# Altium project G5_Adapted.PrjPcb
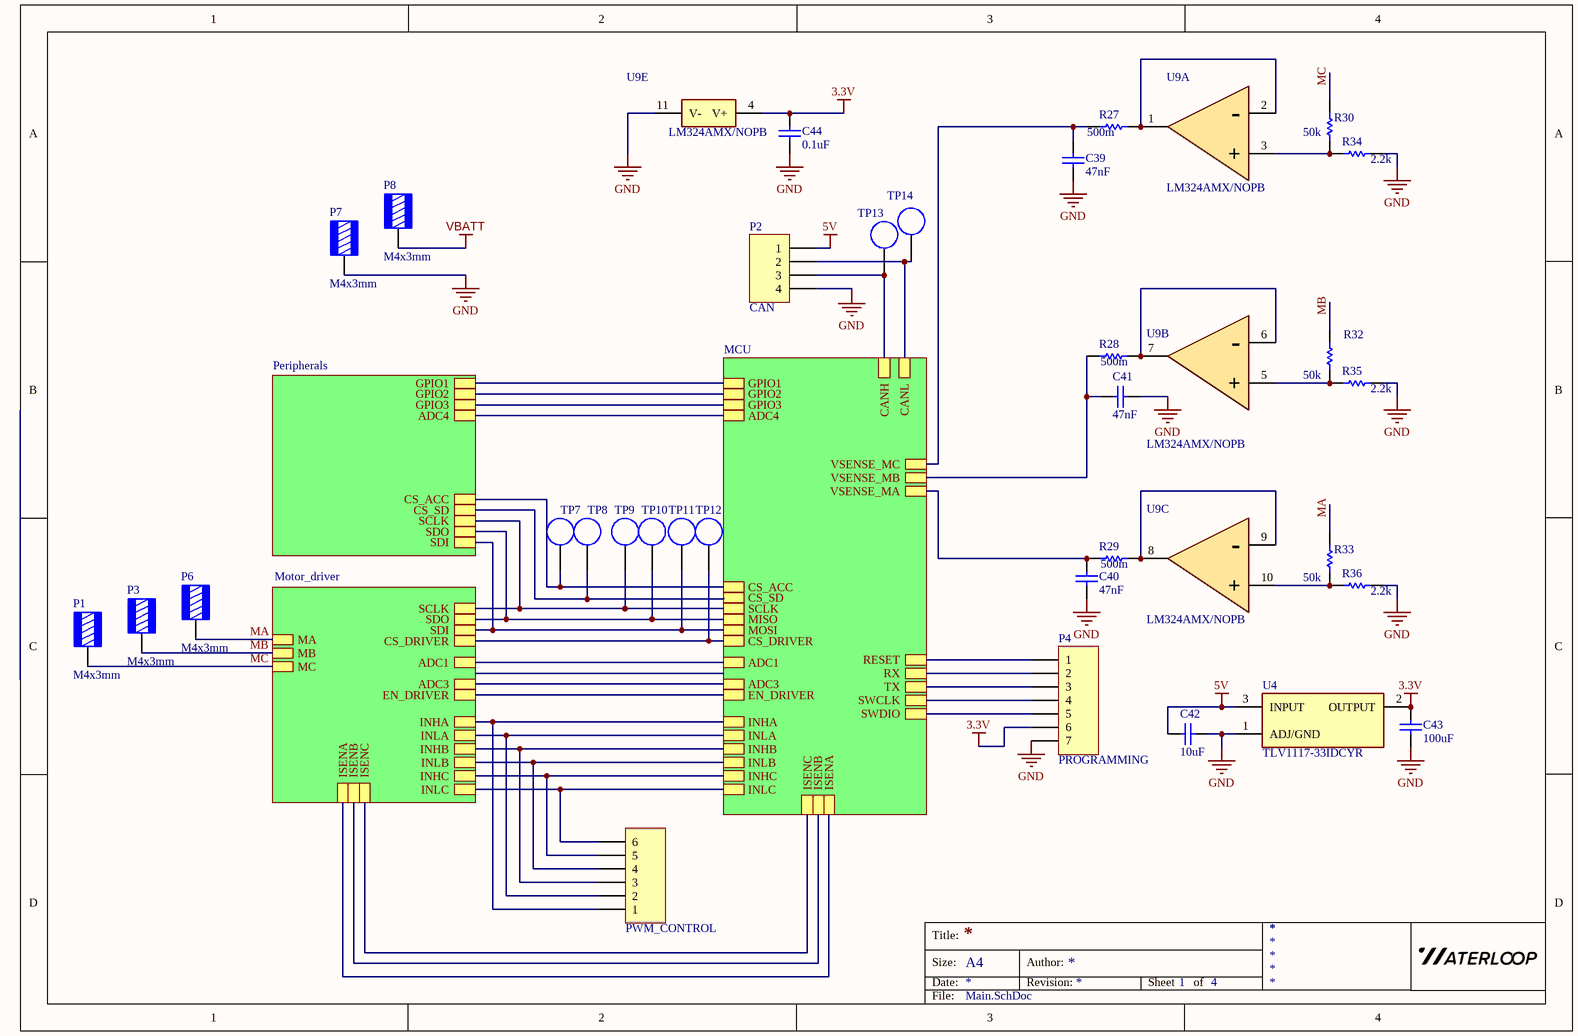
[diagram p0: Main.SchDoc]
4 sheets, 133 parts. Net scope: hierarchical (ports join the sheet entries above them; power ports are global).
Board file: G5_Adapted.PcbDoc
Sheets:
  Main.SchDoc
    MCU = MCU.SchDoc
    Motor_driver = Motor_driver.SchDoc
    Peripherals = Peripherals.SchDoc

## Sheet Main.SchDoc
size A4; SheetNumber: 1; SheetTotal: 4

### Parts
C39  value 47nF  [0805 - Capacitor]  (hidden comment: 100V)
C40  value 47nF  [0805 - Capacitor]  (hidden comment: 100V)
C41  value 47nF  [0805 - Capacitor]  (hidden comment: 100V)
C42  value 10uF  [0805 - Capacitor]  (hidden comment: 100V)
C43  value 100uF  [0805 - Capacitor]  (hidden comment: 100V)
C44  value 0.1uF  [0805 - Capacitor]  (hidden comment: 100V)
P1  M4x3mm  [74650094]
P2  CAN  [b4b-xh]
P3  M4x3mm  [74650094]
P4  PROGRAMMING  [HDR1X7]
P6  M4x3mm  [74650094]
P7  M4x3mm  [74650094]
P8  M4x3mm  [74650094]
R27  500m  [0603 - Resistor]
R28  500m  [0603 - Resistor]
R29  500m  [0603 - Resistor]
R30  50k  [0603 - Resistor]
R32  50k  [0603 - Resistor]
R33  50k  [0603 - Resistor]
R34  2.2k  [0603 - Resistor]
R35  2.2k  [0603 - Resistor]
R36  2.2k  [0603 - Resistor]
TP7  Test Point  [Test Point]  (value not drawn)  (no BOM)
TP8  Test Point  [Test Point]  (value not drawn)  (no BOM)
TP9  Test Point  [Test Point]  (value not drawn)  (no BOM)
TP10  Test Point  [Test Point]  (value not drawn)  (no BOM)
TP11  Test Point  [Test Point]  (value not drawn)  (no BOM)
TP12  Test Point  [Test Point]  (value not drawn)  (no BOM)
TP13  Test Point  [Test Point]  (value not drawn)  (no BOM)
TP14  Test Point  [Test Point]  (value not drawn)  (no BOM)
U4  TLV1117-33IDCYR  [TLV1117]
U9  LM324AMX/NOPB  [LM324AMX/NOPB]  (parts A,B,C,E of 5)
  PWM_CONTROL  [B6B-XH-A(LF)(SN)]

### Sub-sheets
MCU = MCU.SchDoc: CANH, CANL, MOSI, MISO, SCLK, ADC1, INLA, INHA, INHB, INHC, GPIO2, INLB, INLC, SWDIO, SWCLK, TX, GPIO3, RX, GPIO1, CS_SD, ADC4, ADC3, ISENA, ISENB, ISENC, RESET, CS_ACC, CS_DRIVER, EN_DRIVER, VSENSE_MC, VSENSE_MB, VSENSE_MA
Motor_driver = Motor_driver.SchDoc: SCLK, MA, MB, MC, INHA, INLA, INLC, INLB, INHB, INHC, SDO, SDI, ADC1, ADC3, ISENC, ISENA, ISENB, EN_DRIVER, CS_DRIVER
Peripherals = Peripherals.SchDoc: SCLK, GPIO1, GPIO2, GPIO3, SDI, SDO, CS_SD, ADC4, CS_ACC

### Nets
3.3V: C43.1 C44.2 P4.6 U4.2(OUTPUT) U9.4(V+)
5V: C42.1 P2.1 U4.3(INPUT)
GND: C39.1 C40.1 C41.1 C42.2 C43.2 C44.1 P2.4 P4.7 P7.1 R34.1 R35.1 R36.1 U4.1(ADJ/GND) U9.11(V-)
VBATT: P8.1
ADC1: sheet MCU/ADC1, sheet Motor_driver/ADC1
ADC3: sheet MCU/ADC3, sheet Motor_driver/ADC3
ADC4: sheet MCU/ADC4, sheet Peripherals/ADC4
CANH: P2.3 TP13.0 ; sheet MCU/CANH
CANL: P2.2 TP14.0 ; sheet MCU/CANL
CS_ACC: TP7.0 ; sheet MCU/CS_ACC, sheet Peripherals/CS_ACC
CS_DRIVER: TP12.0 ; sheet MCU/CS_DRIVER, sheet Motor_driver/CS_DRIVER
CS_SD: TP8.0 ; sheet MCU/CS_SD, sheet Peripherals/CS_SD
EN_DRIVER: sheet MCU/EN_DRIVER, sheet Motor_driver/EN_DRIVER
GPIO1: sheet MCU/GPIO1, sheet Peripherals/GPIO1
GPIO2: sheet MCU/GPIO2, sheet Peripherals/GPIO2
GPIO3: sheet MCU/GPIO3, sheet Peripherals/GPIO3
INHA: .1 ; sheet MCU/INHA, sheet Motor_driver/INHA
INHB: .3 ; sheet MCU/INHB, sheet Motor_driver/INHB
INHC: .5 ; sheet MCU/INHC, sheet Motor_driver/INHC
INLA: .2 ; sheet MCU/INLA, sheet Motor_driver/INLA
INLB: .4 ; sheet MCU/INLB, sheet Motor_driver/INLB
INLC: .6 ; sheet MCU/INLC, sheet Motor_driver/INLC
ISENA: sheet MCU/ISENA, sheet Motor_driver/ISENA
ISENB: sheet MCU/ISENB, sheet Motor_driver/ISENB
ISENC: sheet MCU/ISENC, sheet Motor_driver/ISENC
MA: P6.1 R33.1 ; sheet Motor_driver/MA
MB: P3.1 R32.1 ; sheet Motor_driver/MB
MC: P1.1 R30.1 ; sheet Motor_driver/MC
RESET: P4.1 ; sheet MCU/RESET
RX: P4.2 ; sheet MCU/RX
SCLK: TP9.0 ; sheet MCU/SCLK, sheet Motor_driver/SCLK, sheet Peripherals/SCLK
SDI: TP11.0 ; sheet MCU/MOSI, sheet Motor_driver/SDI, sheet Peripherals/SDI
SDO: TP10.0 ; sheet MCU/MISO, sheet Motor_driver/SDO, sheet Peripherals/SDO
SWCLK: P4.4 ; sheet MCU/SWCLK
SWDIO: P4.5 ; sheet MCU/SWDIO
TX: P4.3 ; sheet MCU/TX
VSENSE_MA: C40.2 R29.2 ; sheet MCU/VSENSE_MA
VSENSE_MB: C41.2 R28.2 ; sheet MCU/VSENSE_MB
VSENSE_MC: C39.2 R27.2 ; sheet MCU/VSENSE_MC
NetR27_1: R27.1 U9.1 U9.2(-)
NetR28_1: R28.1 U9.6(-) U9.7
NetR29_1: R29.1 U9.8 U9.9(-)
NetR30_2: R30.2 R34.2 U9.3(+)
NetR32_2: R32.2 R35.2 U9.5(+)
NetR33_2: R33.2 R36.2 U9.10(+)

### Notes on the sheet
- Title:
- Size:
- Date:
- A4
- Author:
- Revision:
- Sheet
- of
- File:

### Library data of the parts
C39-C44 = Capacitor - Nonpolarized: CL21B104KCFNNNE, MULTILAYER CERAMIC CAPACITORS MLCC - SMD/SMT 100NF 100V 0805 ROHS; Supplier Part Number: *; Supplier: *; Manufacturer: *; Rating: *; Manufacturer Part Number: *
P1 P3 P6-P8 = 74650094R: WP-THRBU REDCUBE THR internal through-hole thread, 10x10mm, M4x3mm, 8 pins, 85A; Pin Number: 8; Thread: M4; Surface: Tin; Thread Length: 3mm; ComponentLink1Description: Manufacturer; ComponentLink1URL: http://www.we-online.de; ComponentLink2Description: Datasheet; ComponentLink2URL: https://katalog.we-online.com/em/datasheet/74650094R.pdf; Operating Temperature: -55 to +150degC; Height: 3.5mm; Material: Brass; Part Number: 74650094R; Packaging: Tape and Reel; Mounting Technology: SMT; Rated Current: 85A; Publisher: Wurth Elektronik; Published Date: September 2019; Size: 10x10mm
P2 = Header 4: Header, 4-Pin; LatestRevisionDate: 17-Jul-2002; LatestRevisionNote: Re-released for DXP Platform.; Publisher: Altium Limited
P4 = Header 7: Header, 7-Pin; LatestRevisionDate: 17-Jul-2002; LatestRevisionNote: Re-released for DXP Platform.; Publisher: Altium Limited
R27-R30 R32-R36 = Resistor: Rating: *; Manufacturer Part Number: *; Manufacturer: *; Supplier Part Number: *; Supplier: *
  R27-R29: Value: 500m
  R30 R32 R33: Value: 50k
  R34-R36: Value: 2.2k
U4 = TLV1117-33IDCYR: Linear Voltage Regulator IC 3.3V 800MA SOT223-4; Manufacturer: Texas Instruments; Datasheet: http://www.ti.com/lit/ds/symlink/tlv1117.pdf?HQS=TI-null-null-digikeymode-df-pf-null-wwe&ts=1590668900314; Manufacturer Part Number: TLV1117-33IDCYR; Supplier Part Number: 296-21112-1-ND; Supplier: Digikey
U9 = LM324AMX/NOPB: Gen Purp 4Ch Opamp; Manufacturer: TI; Manufacturer Part Number: LM324AMX/NOPB; Supplier Part Number: LM324AMX/NOPBCT-ND; Supplier: Digikey; ComponentLink1Description: Datasheet; ComponentLink1URL: https://www.ti.com/lit/ds/symlink/lm124-n.pdf?HQS=dis-dk-null-digikeymode-dsf-pf-null-wwe&ts=1616555832552
 = Header 6: Header, 6-Pin

## Sheet MCU.SchDoc
size A4; SheetNumber: 2; SheetTotal: 4
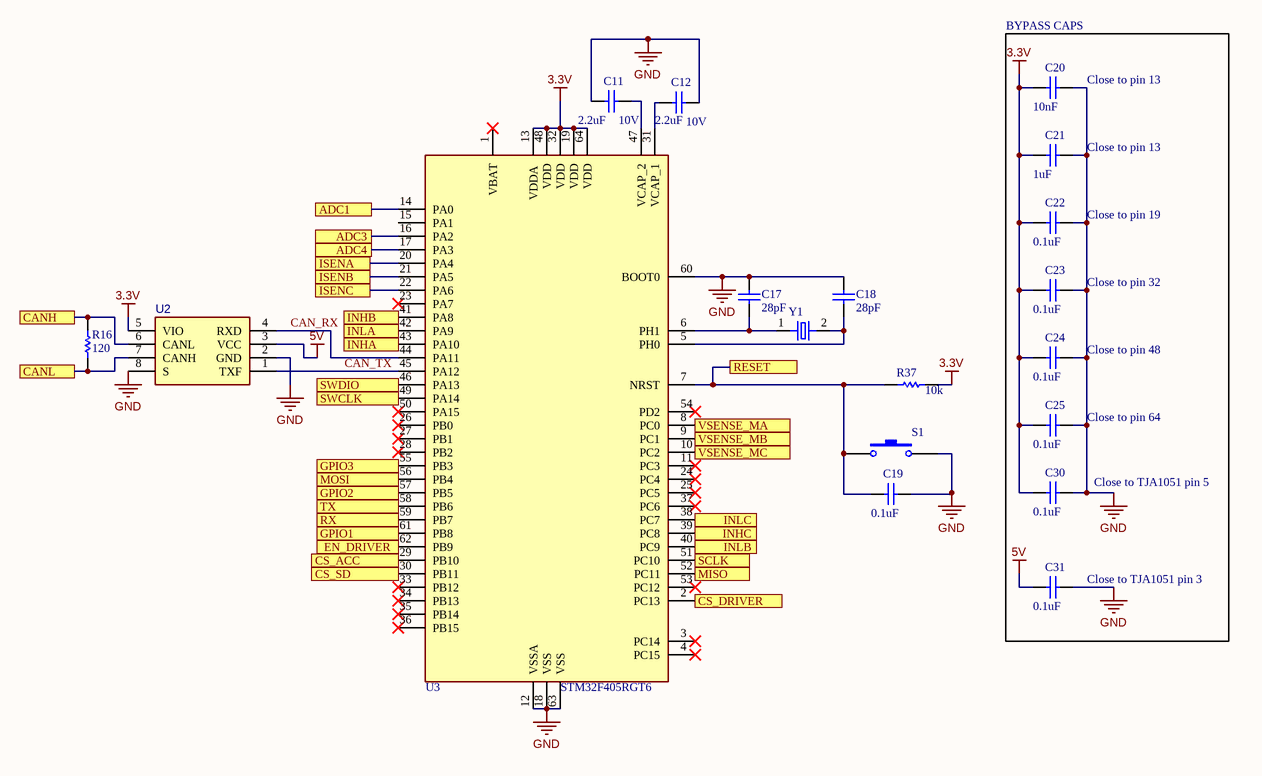
[diagram p1: MCU.SchDoc]

### Parts
C11  10V  value 2.2uF  [0805 - Capacitor]
C12  10V  value 2.2uF  [0805 - Capacitor]
C17  value 28pF  [0805 - Capacitor]  (hidden comment: 100V)
C18  value 28pF  [0805 - Capacitor]  (hidden comment: 100V)
C19  value 0.1uF  [0805 - Capacitor]  (hidden comment: 100V)
C20  value 10nF  [0805 - Capacitor]  (hidden comment: 10V)
C21  value 1uF  [0805 - Capacitor]  (hidden comment: 100V)
C22  value 0.1uF  [0805 - Capacitor]  (hidden comment: 100V)
C23  value 0.1uF  [0805 - Capacitor]  (hidden comment: 100V)
C24  value 0.1uF  [0805 - Capacitor]  (hidden comment: 100V)
C25  value 0.1uF  [0805 - Capacitor]  (hidden comment: 100V)
C30  value 0.1uF  [0805 - Capacitor]  (hidden comment: 100V)
C31  value 0.1uF  [0805 - Capacitor]  (hidden comment: 100V)
R16  value 120  [0603 - Resistor]  (hidden comment: 500m)
R37  10k  [0603 - Resistor]
S1  Switch - Push Button  [6x6mm Switch]  (value not drawn)
U2  (no value)  [TJA1051T/3,118]
U3  STM32F405RGT6  [STM32F405RG]
Y1  ABM3-16.000MHZ-B2-T  [ABM3-16.000MHZ-B2-T]  (value not drawn)

### Ports
ADC1, ADC3, ADC4, CANH, CANL, CS_ACC, CS_DRIVER, CS_SD, EN_DRIVER, GPIO1, GPIO2, GPIO3, INHA, INHB, INHC, INLA, INLB, INLC, ISENA, ISENB, ISENC, MISO, MOSI, RESET, RX, SCLK, SWCLK, SWDIO, TX, VSENSE_MA, VSENSE_MB, VSENSE_MC

### Nets
3.3V: C20.1 C21.1 C22.1 C23.1 C24.1 C25.1 C30.1 R37.1 U2.5(VIO) U3.13(VDDA) U3.19(VDD) U3.32(VDD) U3.48(VDD) U3.64(VDD)
5V: C31.1 U2.3(VCC)
GND: C11.1 C12.2 C17.2 C18.2 C19.2 C20.2 C21.2 C22.2 C23.2 C24.2 C25.2 C30.2 C31.2 S1.2 U2.2(GND) U2.8(S) U3.12(VSSA) U3.18(VSS) U3.60(BOOT0) U3.63(VSS)
ADC1: U3.14(PA0) ; port ADC1
ADC3: U3.16(PA2) ; port ADC3
ADC4: U3.17(PA3) ; port ADC4
CAN_RX: U2.4(RXD) U3.44(PA11)
CAN_TX: U2.1(TXF) U3.45(PA12)
CANH: R16.1 U2.6(CANL) ; port CANH
CANL: R16.2 U2.7(CANH) ; port CANL
CS_ACC: U3.29(PB10) ; port CS_ACC
CS_DRIVER: U3.2(PC13) ; port CS_DRIVER
CS_SD: U3.30(PB11) ; port CS_SD
EN_DRIVER: U3.62(PB9) ; port EN_DRIVER
GPIO1: U3.61(PB8) ; port GPIO1
GPIO2: U3.57(PB5) ; port GPIO2
GPIO3: U3.55(PB3) ; port GPIO3
INHA: U3.43(PA10) ; port INHA
INHB: U3.41(PA8) ; port INHB
INHC: U3.39(PC8) ; port INHC
INLA: U3.42(PA9) ; port INLA
INLB: U3.40(PC9) ; port INLB
INLC: U3.38(PC7) ; port INLC
ISENA: U3.20(PA4) ; port ISENA
ISENB: U3.21(PA5) ; port ISENB
ISENC: U3.22(PA6) ; port ISENC
RESET: C19.1 R37.2 S1.1 U3.7(NRST) ; port RESET
RX: U3.59(PB7) ; port RX
SCLK: U3.51(PC10) ; port SCLK
SDI: U3.56(PB4) ; port MOSI
SDO: U3.52(PC11) ; port MISO
SWCLK: U3.49(PA14) ; port SWCLK
SWDIO: U3.46(PA13) ; port SWDIO
TX: U3.58(PB6) ; port TX
VSENSE_MA: U3.8(PC0) ; port VSENSE_MA
VSENSE_MB: U3.9(PC1) ; port VSENSE_MB
VSENSE_MC: U3.10(PC2) ; port VSENSE_MC
NetC11_2: C11.2 U3.47(VCAP_2)
NetC12_1: C12.1 U3.31(VCAP_1)
NetC17_1: C17.1 U3.6(PH1) Y1.1
NetC18_1: C18.1 U3.5(PH0) Y1.2

Not connected (* = marked no-connect by the designer): U3 1(VBAT)* 3(PC14)* 4(PC15)* 11(PC3)* 15(PA1) 23(PA7)* 24(PC4)* 25(PC5)* 26(PB0)* 27(PB1)* 28(PB2)* 33(PB12)* 34(PB13)* 35(PB14)* 36(PB15)* 37(PC6)* 50(PA15)* 53(PC12)* 54(PD2)*

### Notes on the sheet
- BYPASS CAPS
- (near C20) Close to pin 13
- (near C21) Close to pin 13
- (near C22) Close to pin 19
- (near C23) Close to pin 32
- (near C24) Close to pin 48
- (near C25) Close to pin 64
- (near C30) Close to TJA1051 pin 5
- (near C31) Close to TJA1051 pin 3
- Title:
- Size:
- Date:
- A4
- Author:
- Revision:
- Sheet
- of
- File:

### Library data of the parts
C11 C12 = Capacitor - Nonpolarized: Nonpolarized Capacitor; Supplier Part Number: *; Supplier: *; Manufacturer: *; Rating: *; Manufacturer Part Number: *
C17-C19 C22-C25 C30 C31 = Capacitor - Nonpolarized: as C39 on sheet Main; Supplier Part Number: *; Supplier: *; Manufacturer: *; Rating: *; Manufacturer Part Number: *
C20 = Capacitor - Nonpolarized: C0805C103K8RAC7800. 10000pF ±10% 10V Ceramic Capacitor X7R 0805 (2012 Metric) /; Supplier Part Number: *; Supplier: *; Manufacturer: *; Rating: *; Manufacturer Part Number: *
C21 = Capacitor - Nonpolarized: TDK C2012X7S2A105KT000N, 1UF ±10% 100V X7S 0805 MULTILAYER CERAMIC CAPACITORS MLCC - SMD/SMT ROHS; Supplier Part Number: *; Supplier: *; Manufacturer: *; Rating: *; Manufacturer Part Number: *
R16 R37 = Resistor: Rating: *; Manufacturer Part Number: *; Manufacturer: *; Supplier Part Number: *; Supplier: *
  R37: Value: 10k
S1 = Switch - Push Button: Push Button Switch; Supplier: *; Manufacturer Part Number: *; Manufacturer: *; Supplier Part Number: *; Rating: *; Value: *
U2 = TJA1051T_3,118: Integrated Circuit; Manufacturer_Name: NXP; Datasheet Link: http://www.nxp.com/docs/en/data-sheet/TJA1051.pdf; Height: 1.75mm; Manufacturer_Part_Number: TJA1051T/3,118; Arrow Part Number: TJA1051T/3,118; Arrow Price/Stock: https://www.arrow.com/en/products/tja1051t3118/nxp-semiconductors; Mouser Part Number: 771-TJA1051T3118; Mouser Price/Stock: https://www.mouser.co.uk/ProductDetail/NXP-Semiconductors/TJA1051T-3118?qs=O%2F7ihdSJpebv1PFlp05wnQ%3D%3D
U3 = STM32F405RGT6: ST 64-pin Micro; Manufacturer Part Number: STM32F405RG; Manufacturer: ST; Supplier Part Number: 497-11767-ND; Supplier: Digikey; ComponentLink1Description: Datsheet; ComponentLink1URL: https://www.st.com/content/ccc/resource/technical/document/datasheet/ef/92/76/6d/bb/c2/4f/f7/DM00037051.pdf/files/DM00037051.pdf/jcr:content/translations/en.DM00037051.pdf
Y1 = ABM3-16.000MHZ-B2-T: 16MHz Â±20ppm Crystal 18pF 40 Ohms 2-SMD, No Lead; MF: Abracon; Value: *; MP: ABM3-16.000MHZ-B2-T; Package: SMD-2 Abracon; SnapEDA_Link: https://www.snapeda.com/parts/ABM3-16.000MHZ-B2-T/Abracon%20LLC/view-part/55266/?ref=snap; Digi-Key_Part_Number: 535-9103-1-ND; Digi-Key_Purchase_URL: https://www.digikey.com/product-detail/en/abracon-llc/ABM3-16.000MHZ-B2-T/535-9103-1-ND/675620?utm_source=snapeda&utm_medium=aggregator&utm_campaign=symbol

## Sheet Motor_driver.SchDoc
size A4; SheetNumber: 3; SheetTotal: 4
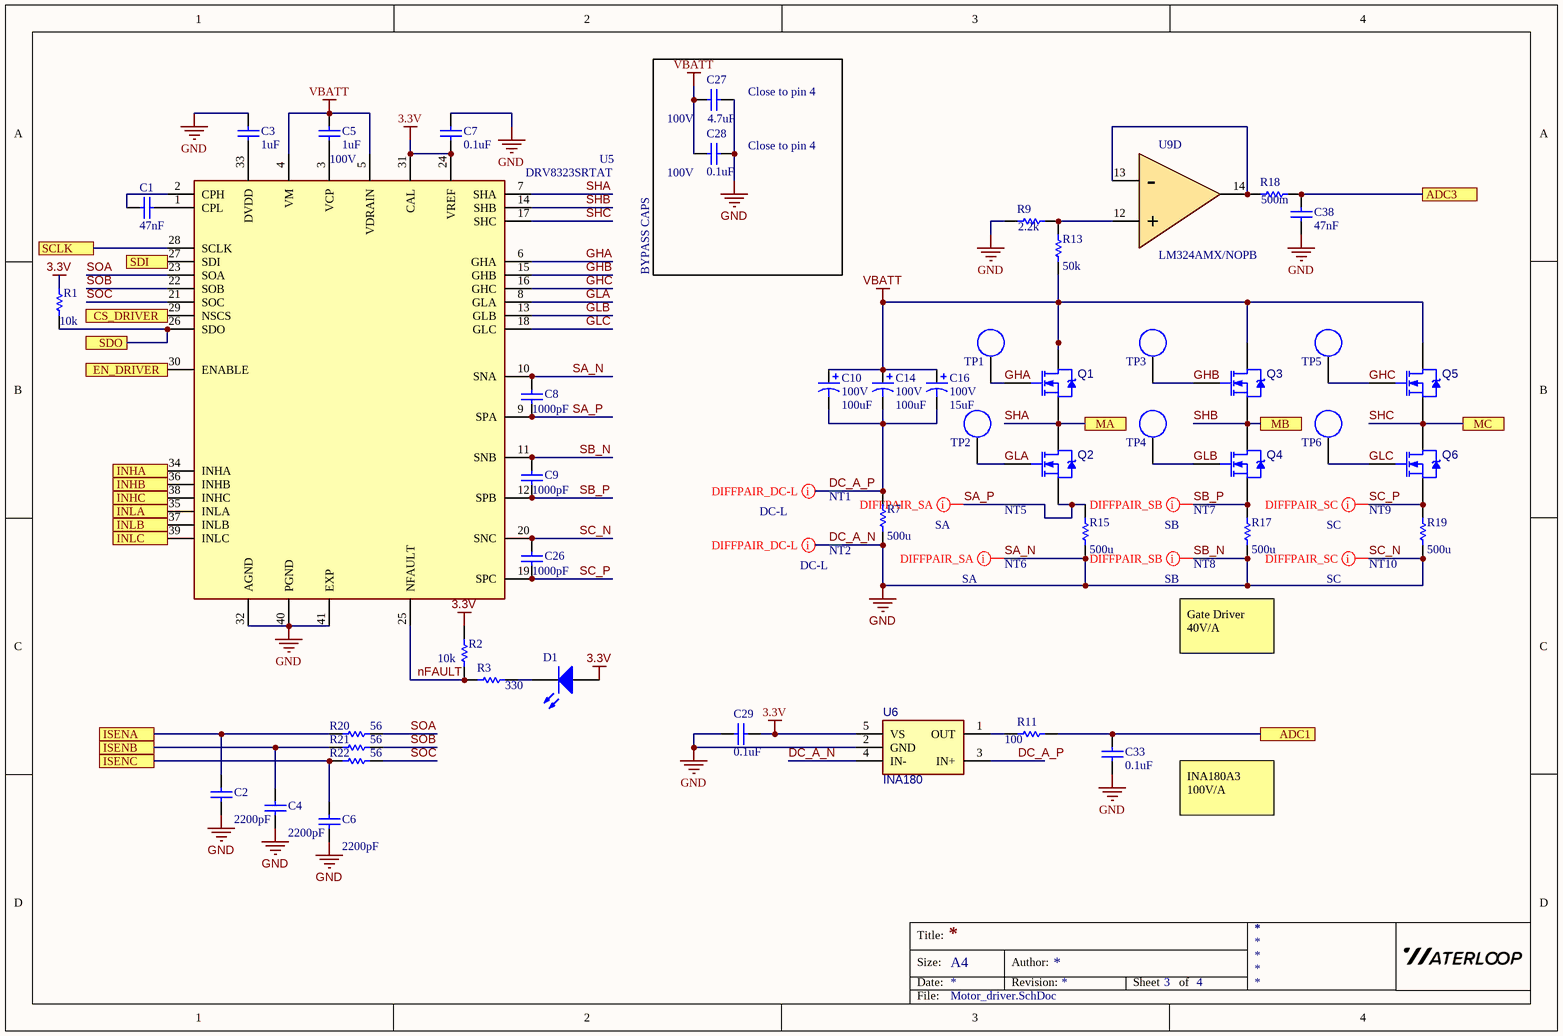
[diagram p2: Motor_driver.SchDoc]

### Parts
C1  value 47nF  [0805 - Capacitor]  (hidden comment: 100V)
C2  value 2200pF  [0805 - Capacitor]  (hidden comment: 10V)
C3  value 1uF  [0805 - Capacitor]  (hidden comment: 100V)
C4  value 2200pF  [0805 - Capacitor]  (hidden comment: 10V)
C5  100V  value 1uF  [0805 - Capacitor]
C6  value 2200pF  [0805 - Capacitor]  (hidden comment: 10V)
C7  value 0.1uF  [0805 - Capacitor]  (hidden comment: 100V)
C8  value 1000pF  [0805 - Capacitor]  (hidden comment: 10V)
C9  value 1000pF  [0805 - Capacitor]  (hidden comment: 10V)
C10  100V  value 100uF  [Electrolytic Cap]
C14  100V  value 100uF  [Electrolytic Cap]
C16  100V  value 15uF  [Electrolytic Cap]
C26  value 1000pF  [0805 - Capacitor]  (hidden comment: 10V)
C27  100V  value 4.7uF  [1210 - Capacitor]
C28  100V  value 0.1uF  [0805 - Capacitor]
C29  value 0.1uF  [0805 - Capacitor]  (hidden comment: 100V)
C33  value 0.1uF  [0805 - Capacitor]  (hidden comment: 100V)
C38  value 47nF  [0805 - Capacitor]  (hidden comment: 100V)
D1  150080SS75000  [0805_A]  (value not drawn)
NT1  NetTie  [Net Tie]  (value not drawn)  (net tie, no BOM)
NT2  NetTie  [Net Tie]  (value not drawn)  (net tie, no BOM)
NT5  NetTie  [Net Tie]  (value not drawn)  (net tie, no BOM)
NT6  NetTie  [Net Tie]  (value not drawn)  (net tie, no BOM)
NT7  NetTie  [Net Tie]  (value not drawn)  (net tie, no BOM)
NT8  NetTie  [Net Tie]  (value not drawn)  (net tie, no BOM)
NT9  NetTie  [Net Tie]  (value not drawn)  (net tie, no BOM)
NT10  NetTie  [Net Tie]  (value not drawn)  (net tie, no BOM)
Q1  NMOS-2  [TO254P1651X1067X470-3]  (value not drawn)
Q2  NMOS-2  [TO254P1651X1067X470-3]  (value not drawn)
Q3  NMOS-2  [TO254P1651X1067X470-3]  (value not drawn)
Q4  NMOS-2  [TO254P1651X1067X470-3]  (value not drawn)
Q5  NMOS-2  [TO254P1651X1067X470-3]  (value not drawn)
Q6  NMOS-2  [TO254P1651X1067X470-3]  (value not drawn)
R1  10k  [0603 - Resistor]
R2  10k  [0603 - Resistor]
R3  330  [0603 - Resistor]
R7  500u  [RESC6430X66N]
R9  2.2k  [0603 - Resistor]
R11  100  [0603 - Resistor]
R13  50k  [0603 - Resistor]
R15  500u  [RESC6430X66N]
R17  500u  [RESC6430X66N]
R18  500m  [0603 - Resistor]
R19  500u  [RESC6430X66N]
R20  56  [0603 - Resistor]
R21  56  [0603 - Resistor]
R22  56  [0603 - Resistor]
TP1  Test Point  [Test Point]  (value not drawn)  (no BOM)
TP2  Test Point  [Test Point]  (value not drawn)  (no BOM)
TP3  Test Point  [Test Point]  (value not drawn)  (no BOM)
TP4  Test Point  [Test Point]  (value not drawn)  (no BOM)
TP5  Test Point  [Test Point]  (value not drawn)  (no BOM)
TP6  Test Point  [Test Point]  (value not drawn)  (no BOM)
U5  DRV8323SRTAT  [DRV8323SRTAT]
U6  INA180  [INA180]
U9  LM324AMX/NOPB  [LM324AMX/NOPB]  (part D of 5)

### Ports
ADC1, ADC3, CS_DRIVER, EN_DRIVER, INHA, INHB, INHC, INLA, INLB, INLC, ISENA, ISENB, ISENC, MA, MB, MC, SCLK, SDI, SDO

### Nets
3.3V: C7.1 C29.1 D1.2(A) R1.1 R2.1 U5.24(VREF) U5.31(CAL) U6.5(VS)
GND: C2.2 C3.2 C4.2 C6.2 C7.2 C27.1 C28.1 C29.2 C33.2 C38.1 NT2.2 NT6.2 NT8.2 NT10.2 R7.1 R9.1 R15.1 R17.1 R19.1 U5.32(AGND) U5.40(PGND) U5.41(EXP) U6.2(GND)
VBATT: C5.2 C10.1 C14.1 C16.1 C27.2 C28.2 Q1.2(D) Q3.2(D) Q5.2(D) R13.2 U5.4(VM) U5.5(VDRAIN)
ADC1: C33.1 R11.2 ; port ADC1
ADC3: C38.2 R18.2 ; port ADC3
CS_DRIVER: U5.29(NSCS) ; port CS_DRIVER
DC_A_N: NT2.1 U6.4(IN-)
DC_A_P: NT1.1 U6.3(IN+)
EN_DRIVER: U5.30(ENABLE) ; port EN_DRIVER
GHA: Q1.1(G) TP1.0 U5.6(GHA)
GHB: Q3.1(G) TP3.0 U5.15(GHB)
GHC: Q5.1(G) TP5.0 U5.16(GHC)
GLA: Q2.1(G) TP2.0 U5.8(GLA)
GLB: Q4.1(G) TP4.0 U5.13(GLB)
GLC: Q6.1(G) TP6.0 U5.18(GLC)
INHA: U5.34(INHA) ; port INHA
INHB: U5.36(INHB) ; port INHB
INHC: U5.38(INHC) ; port INHC
INLA: U5.35(INLA) ; port INLA
INLB: U5.37(INLB) ; port INLB
INLC: U5.39(INLC) ; port INLC
ISENA: C2.1 R20.2 ; port ISENA
ISENB: C4.1 R21.2 ; port ISENB
ISENC: C6.1 R22.2 ; port ISENC
nFAULT: R2.2 R3.2 U5.25(NFAULT)
SA_N: C8.1 NT6.1 U5.10(SNA)
SA_P: C8.2 NT5.1 U5.9(SPA)
SB_N: C9.1 NT8.1 U5.11(SNB)
SB_P: C9.2 NT7.1 U5.12(SPB)
SC_N: C26.1 NT10.1 U5.20(SNC)
SC_P: C26.2 NT9.1 U5.19(SPC)
SCLK: U5.28(SCLK) ; port SCLK
SDI: U5.27(SDI) ; port SDI
SDO: R1.2 U5.26(SDO) ; port SDO
SHA: Q1.3(S) Q2.2(D) U5.7(SHA) ; port MA  [project net MA]
SHB: Q3.3(S) Q4.2(D) U5.14(SHB) ; port MB  [project net MB]
SHC: Q5.3(S) Q6.2(D) U5.17(SHC) ; port MC  [project net MC]
SOA: R20.1 U5.23(SOA)
SOB: R21.1 U5.22(SOB)
SOC: R22.1 U5.21(SOC)
NetC1_1: C1.1 U5.1(CPL)
NetC1_2: C1.2 U5.2(CPH)
NetC3_1: C3.1 U5.33(DVDD)
NetC5_1: C5.1 U5.3(VCP)
NetC10_2: C10.2 C14.2 C16.2 NT1.2 R7.2
NetD1_1: D1.1(K) R3.1
NetNT5_2: NT5.2 Q2.3(S) R15.2
NetNT7_2: NT7.2 Q4.3(S) R17.2
NetNT9_2: NT9.2 Q6.3(S) R19.2
NetR9_2: R9.2 R13.1 U9.12(+)
NetR11_1: R11.1 U6.1(OUT)
NetR18_1: R18.1 U9.13(-) U9.14

### Layout directives
differential pair; Parameter 1: SA: SA_N, SA_P
differential pair; Parameter 1: SB: SB_N, SB_P
differential pair; Parameter 1: SC: SC_N, SC_P
differential pair; Parameter 1: DC-L: DC_A_N, DC_A_P

### Notes on the sheet
- (near C27) Close to pin 4
- (near C28) Close to pin 4
- BYPASS CAPS
- Gate Driver 40V/A
- INA180A3 100V/A
- Title:
- Size:
- Date:
- A4
- Author:
- Revision:
- Sheet
- of
- File:

### Library data of the parts
C1 C7 C28 C29 C33 C38 = Capacitor - Nonpolarized: as C39 on sheet Main; Supplier Part Number: *; Supplier: *; Manufacturer: *; Rating: *; Manufacturer Part Number: *
C2-C6 C8 C9 C26 C27 = Capacitor - Nonpolarized: as C21 on sheet MCU; Supplier Part Number: *; Supplier: *; Manufacturer: *; Rating: *; Manufacturer Part Number: *
C10 C14 = Cap Pol3: 100ZLH100MEFC10X20, Aluminum Electrolytic Capacitors Radial, Can - 10000 Hrs @ 105°C, 100UF 20% 100V /; Published: 8-Jun-2000; LatestRevisionDate: 29-May-2009; LatestRevisionNote: IPC-7351 Footprint Added.; PackageReference: C0805; Publisher: Altium Limited; PackageDescription: Chip Capacitor
C16 = Cap Pol3: EEU-EE2V150, Aluminum Electrolytic Capacitors Radial, Can - 8000 Hrs @ 105°C, CAP ALUM 15UF 20% 350V RADIAL /; Published: 8-Jun-2000; LatestRevisionDate: 29-May-2009; LatestRevisionNote: IPC-7351 Footprint Added.; PackageReference: C0805; Publisher: Altium Limited; PackageDescription: Chip Capacitor
D1 = CMP-1426-00010-1: SMD mono-color Chip LED, WL-SMCW, Super Red; Manufacturer: Wuerth Elektronik; PackageReference: 0805_A; ComponentLink2URL: http://katalog.we-online.com/led/datasheet/150080SS75000.pdf; ComponentLink1URL: http://www.we-online.com; Color: Super Red; ComponentLink2Description: Datasheet; ComponentLink1Description: Manufacturer URL; PartNumber: 150080SS75000
NT1 NT2 NT5-NT10 = Net Tie
Q1-Q6 = NMOS-2: N-Channel Power MOSFET; Note: Pin 2 is electrically connected to pin 4.; Published: 8-Jun-2000; LatestRevisionDate: 17-Jul-2002; LatestRevisionNote: Re-released for DXP Platform.; DatasheetVersion: PD-9.814; PackageVersion: Feb-1997; PackageReference: TO-220AB; Publisher: Altium Limited; PackageDescription: TO, Thru-Hole, Vertical, Heatsink Mounted; 3 In-Line Leads; Pitch 2.54 mm; ComponentLink1Description: Manufacturer Link; ComponentLink1URL: http://www.irf.com/
R1-R3 R7 R9 R11 R13 R15 R17-R22 = Resistor: Rating: *; Manufacturer Part Number: *; Manufacturer: *; Supplier Part Number: *; Supplier: *
  R1 R2: Value: 10k
  R3: Value: 330
  R7 R15 R17 R19: Value: 500u
  R9: Value: 2.2k
  R11: Value: 100
  R13: Value: 50k
  R18: Value: 500m
  R20-R22: Value: 56
U5 = DRV8323SRTAT: Multiphase Motor Driver Power MOSFET SPI 40-WQFN _6x6_; MF: Texas Instruments; SnapEDA_Link: https://www.snapeda.com/parts/DRV8323SRTAT/Texas%20Instruments/view-part/1675025/?ref=snap; Price: None; MP: DRV8323SRTAT; Package: WQFN-40 Texas Instruments; Value: *; Availability: Unavailable
U6 = INA180: 0V to 26V Current Sense Amplifier; Manufacturer: Texas Instruments; Manufacturer Part Number: INA180A2IDBVR; Datasheet: https://www.ti.com/lit/ds/symlink/ina180.pdf; Supplier Part Number: 296-47653-1-ND; Supplier: Digikey
U9 = LM324AMX/NOPB: Gen Purp 4Ch Opamp; Manufacturer: TI; Manufacturer Part Number: LM324AMX/NOPB; Supplier Part Number: LM324AMX/NOPBCT-ND; Supplier: Digikey; ComponentLink1Description: Datasheet; ComponentLink1URL: https://www.ti.com/lit/ds/symlink/lm124-n.pdf?HQS=dis-dk-null-digikeymode-dsf-pf-null-wwe&ts=1616555832552

## Sheet Peripherals.SchDoc
size A4; SheetNumber: 4; SheetTotal: 4
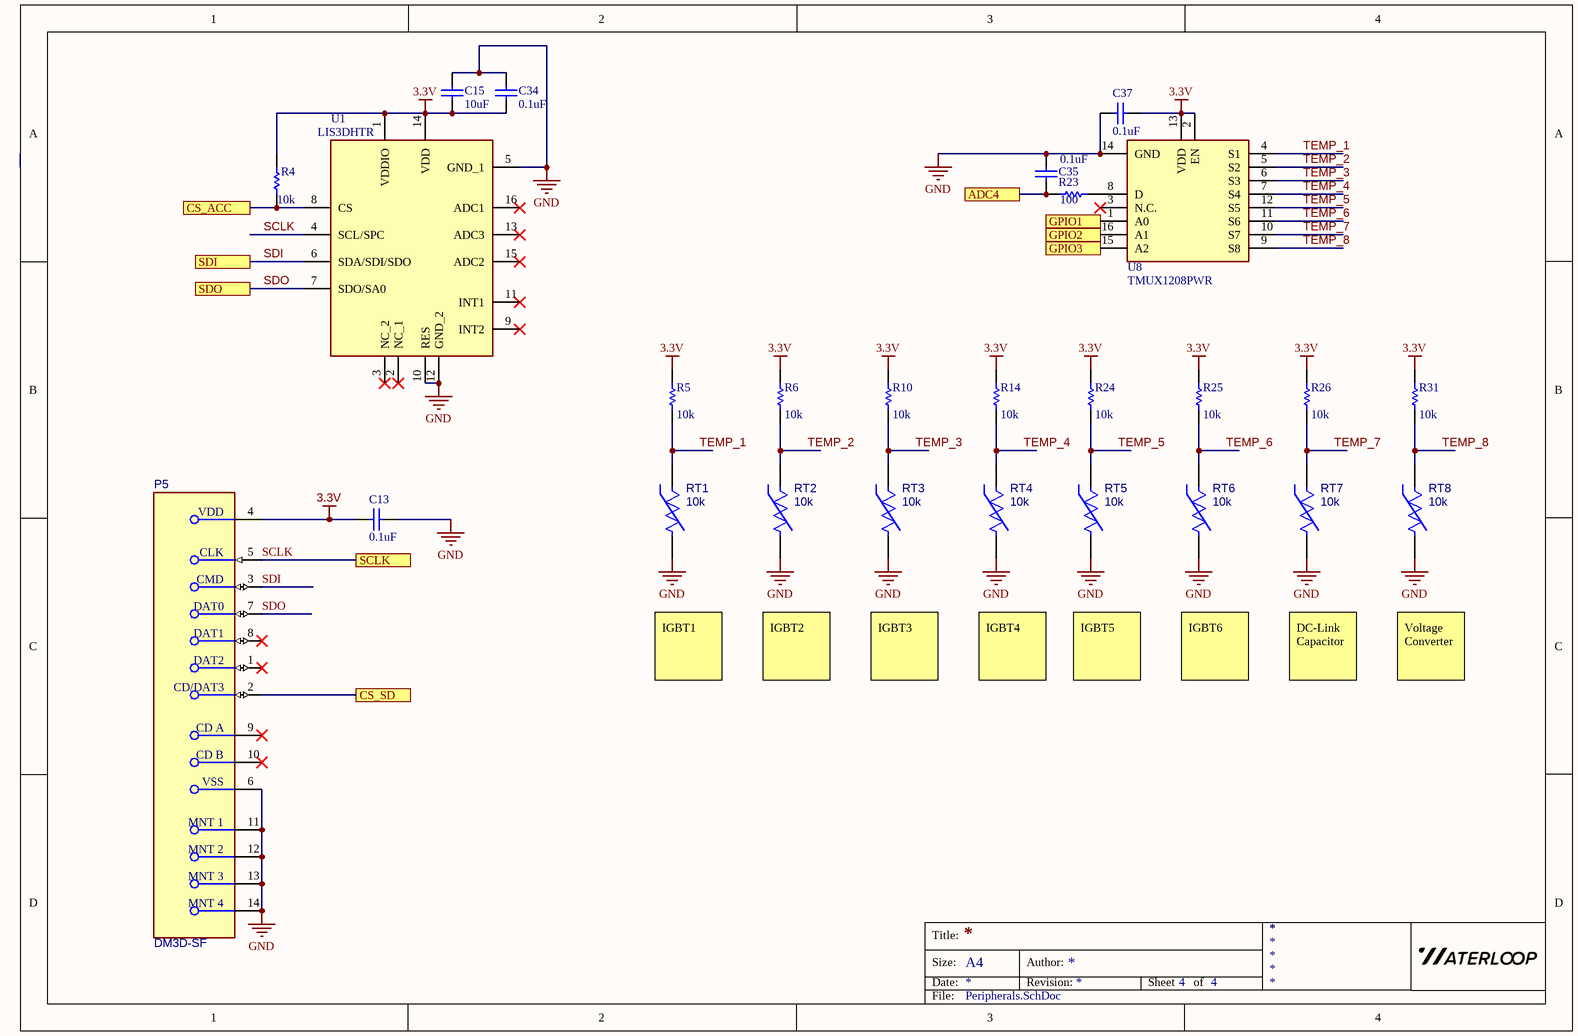
[diagram p3: Peripherals.SchDoc]

### Parts
C13  value 0.1uF  [0805 - Capacitor]  (hidden comment: 100V)
C15  value 10uF  [0805 - Capacitor]  (hidden comment: 100V)
C34  value 0.1uF  [0805 - Capacitor]  (hidden comment: 100V)
C35  value 0.1uF  [0805 - Capacitor]  (hidden comment: 100V)
C37  value 0.1uF  [0805 - Capacitor]  (hidden comment: 100V)
P5  DM3D-SF  [FP-DM3D-SF-MFG]
R4  10k  [0603 - Resistor]
R5  10k  [0603 - Resistor]
R6  10k  [0603 - Resistor]
R10  10k  [0603 - Resistor]
R14  10k  [0603 - Resistor]
R23  100  [0603 - Resistor]
R24  10k  [0603 - Resistor]
R25  10k  [0603 - Resistor]
R26  10k  [0603 - Resistor]
R31  10k  [0603 - Resistor]
RT1  10k  [ERT-J1VG103JA]
RT2  10k  [ERT-J1VG103JA]
RT3  10k  [ERT-J1VG103JA]
RT4  10k  [ERT-J1VG103JA]
RT5  10k  [ERT-J1VG103JA]
RT6  10k  [ERT-J1VG103JA]
RT7  10k  [ERT-J1VG103JA]
RT8  10k  [ERT-J1VG103JA]
U1  LIS3DHTR  [LIS3DHTR]
U8  TMUX1208PWR  [SOP65P640X120-16N]

### Ports
ADC4, CS_ACC, CS_SD, GPIO1, GPIO2, GPIO3, SCLK, SDI, SDO

### Nets
3.3V: C13.2 C15.2 C34.2 C37.1 P5.4(VDD) R4.2 R5.1 R6.2 R10.2 R14.2 R24.2 R25.2 R26.2 R31.2 U1.1(VDDIO) U1.14(VDD) U8.2(EN) U8.13(VDD)
GND: C13.1 C15.1 C34.1 C35.1 C37.2 P5.6(VSS) P5.11(MNT_1) P5.12(MNT_2) P5.13(MNT_3) P5.14(MNT_4) RT1.2 RT2.2 RT3.2 RT4.2 RT5.2 RT6.2 RT7.2 RT8.2 U1.5(GND_1) U1.10(RES) U1.12(GND_2) U8.14(GND)
ADC4: C35.2 R23.2 ; port ADC4
CS_ACC: R4.1 U1.8(CS) ; port CS_ACC
CS_SD: P5.2(CD/DAT3) ; port CS_SD
GPIO1: U8.1(A0) ; port GPIO1
GPIO2: U8.16(A1) ; port GPIO2
GPIO3: U8.15(A2) ; port GPIO3
SCLK: P5.5(CLK) U1.4(SCL/SPC) ; port SCLK
SDI: P5.3(CMD) U1.6(SDA/SDI/SDO) ; port SDI
SDO: P5.7(DAT0) U1.7(SDO/SA0) ; port SDO
TEMP_1: R5.2 RT1.1 U8.4(S1)
TEMP_2: R6.1 RT2.1 U8.5(S2)
TEMP_3: R10.1 RT3.1 U8.6(S3)
TEMP_4: R14.1 RT4.1 U8.7(S4)
TEMP_5: R24.1 RT5.1 U8.12(S5)
TEMP_6: R25.1 RT6.1 U8.11(S6)
TEMP_7: R26.1 RT7.1 U8.10(S7)
TEMP_8: R31.1 RT8.1 U8.9(S8)
NetR23_1: R23.1 U8.8(D)

Not connected (* = marked no-connect by the designer): P5 1(DAT2)* 8(DAT1)* 9(CD_A)* 10(CD_B)*; U1 2(NC_1)* 3(NC_2)* 9(INT2)* 11(INT1)* 13(ADC3)* 15(ADC2)* 16(ADC1)*; U8 3(N.C.)*

### Notes on the sheet
- IGBT1
- IGBT2
- IGBT3
- IGBT4
- IGBT5
- IGBT6
- DC-Link Capacitor
- Voltage Converter
- Title:
- Size:
- Date:
- A4
- Author:
- Revision:
- Sheet
- of
- File:

### Library data of the parts
C13 C15 C34 C35 C37 = Capacitor - Nonpolarized: as C39 on sheet Main; Supplier Part Number: *; Supplier: *; Manufacturer: *; Rating: *; Manufacturer Part Number: *
P5 = CMP-2000-06166-2: CONN MICRO SD CARD PUSH-PULL; Insulation Resistance: 1GR; Max Voltage Rating (AC): 125V; Gender: Female; Contact Resistance: 100mR; Current Rating: 500mA; Pitch: 1.1mm; Connector Type: Connector; Number of Contacts: 8; Contact Plating: Gold; Number of Rows: 1; Termination: Solder; Contact Material: Copper Alloy; REACH SVHC: No SVHC; Voltage Rating (AC): 125V; Packaging: Tape and Reel; Housing Material: Polymer; Max Operating Temperature: 85°C; Package Quantity: 1; Min Operating Temperature: -25°C; Lead Free: Lead Free; Orientation: Right Angle; Radiation Hardening: No; Flammability Rating: UL94 V-0; Mount: Surface Mount; Depth: 11.45mm; Max Current Rating: 500mA; Length: 11.95mm; Width: 11.95mm
R4-R6 R10 R14 R23-R26 R31 = Resistor: Rating: *; Manufacturer Part Number: *; Manufacturer: *; Supplier Part Number: *; Supplier: *
  R4-R6 R10 R14 R24-R26 R31: Value: 10k
  R23: Value: 100
RT1-RT8 = ERT-J1VG103JA: NTC Thermistor for Temperature Sensor, SMD 0603, 10kΩ; Resistance Tolerance: 1%; Current Rating: 140uA; Power Rating: 100mW; Resistance: 47kR; Case/Package: 0402; Packaging: Tape and Reel; Radiation Hardening: No; Min Operating Temperature: -40°C; Lead Free: Lead Free; Mount: Surface Mount; RoHS Compliant: Yes; Number of Pins: 2; Package Quantity: 10000; Case Code (Metric): 1005; Max Operating Temperature: 125°C; Max Power Dissipation: 100mW; Series: NCP; Height: 0.5mm; Depth: 0.5mm; Termination: SMD/SMT; Case Code (Imperial): 0402; Tolerance: 1%; Length: 1mm
U1 = LIS3DHTR: Accelerometer; Manufacturer_Name: STMicroelectronics; Datasheet Link: http://www.st.com/content/ccc/resource/technical/document/datasheet/3c/ae/50/85/d6/b1/46/fe/CD00274221.pdf/files/CD00274221.pdf/jcr:content/translations/en.CD00274221.pdf; Height: 1mm; Manufacturer_Part_Number: LIS3DHTR; Mouser Part Number: 511-LIS3DHTR; Mouser Price/Stock: https://www.mouser.co.uk/ProductDetail/STMicroelectronics/LIS3DHTR/?qs=6la6oa3D8xzhXYax3cEo4w%3D%3D; Arrow Part Number: LIS3DHTR; Arrow Price/Stock: https://www.arrow.com/en/products/lis3dhtr/stmicroelectronics
U8 = TMUX1208PWR: Integrated Circuit; Manufacturer_Name: Texas Instruments; Datasheet Link: http://www.ti.com/lit/gpn/tmux1208; Height: 1.2mm; Manufacturer_Part_Number: TMUX1208PWR; Mouser Part Number: 595-TMUX1208PWR; Mouser Price/Stock: https://www.mouser.co.uk/ProductDetail/Texas-Instruments/TMUX1208PWR/?qs=lc2O%252BfHJPVbYdIGs2%2FdugA%3D%3D; Arrow Part Number: TMUX1208PWR; Arrow Price/Stock: https://www.arrow.com/en/products/tmux1208pwr/texas-instruments

## Nets that join several sheets
3.3V: Main (5 pins), MCU (14 pins), Motor_driver (8 pins), Peripherals (18 pins)
5V: Main (C42.1 P2.1 U4.3), MCU (C31.1 U2.3)
GND: Main (14 pins), MCU (20 pins), Motor_driver (23 pins), Peripherals (22 pins)
VBATT: Main (P8.1), Motor_driver (12 pins)
ADC1: MCU (U3.14), Motor_driver (C33.1 R11.2)
ADC3: MCU (U3.16), Motor_driver (C38.2 R18.2)
ADC4: MCU (U3.17), Peripherals (C35.2 R23.2)
CANH: Main (P2.3 TP13.0), MCU (R16.1 U2.6)
CANL: Main (P2.2 TP14.0), MCU (R16.2 U2.7)
CS_ACC: Main (TP7.0), MCU (U3.29), Peripherals (R4.1 U1.8)
CS_DRIVER: Main (TP12.0), MCU (U3.2), Motor_driver (U5.29)
CS_SD: Main (TP8.0), MCU (U3.30), Peripherals (P5.2)
EN_DRIVER: MCU (U3.62), Motor_driver (U5.30)
GPIO1: MCU (U3.61), Peripherals (U8.1)
GPIO2: MCU (U3.57), Peripherals (U8.16)
GPIO3: MCU (U3.55), Peripherals (U8.15)
INHA: Main (.1), MCU (U3.43), Motor_driver (U5.34)
INHB: Main (.3), MCU (U3.41), Motor_driver (U5.36)
INHC: Main (.5), MCU (U3.39), Motor_driver (U5.38)
INLA: Main (.2), MCU (U3.42), Motor_driver (U5.35)
INLB: Main (.4), MCU (U3.40), Motor_driver (U5.37)
INLC: Main (.6), MCU (U3.38), Motor_driver (U5.39)
ISENA: MCU (U3.20), Motor_driver (C2.1 R20.2)
ISENB: MCU (U3.21), Motor_driver (C4.1 R21.2)
ISENC: MCU (U3.22), Motor_driver (C6.1 R22.2)
MA: Main (P6.1 R33.1), Motor_driver (Q1.3 Q2.2 U5.7)
MB: Main (P3.1 R32.1), Motor_driver (Q3.3 Q4.2 U5.14)
MC: Main (P1.1 R30.1), Motor_driver (Q5.3 Q6.2 U5.17)
RESET: Main (P4.1), MCU (C19.1 R37.2 S1.1 U3.7)
RX: Main (P4.2), MCU (U3.59)
SCLK: Main (TP9.0), MCU (U3.51), Motor_driver (U5.28), Peripherals (P5.5 U1.4)
SDI: Main (TP11.0), MCU (U3.56), Motor_driver (U5.27), Peripherals (P5.3 U1.6)
SDO: Main (TP10.0), MCU (U3.52), Motor_driver (R1.2 U5.26), Peripherals (P5.7 U1.7)
SWCLK: Main (P4.4), MCU (U3.49)
SWDIO: Main (P4.5), MCU (U3.46)
TX: Main (P4.3), MCU (U3.58)
VSENSE_MA: Main (C40.2 R29.2), MCU (U3.8)
VSENSE_MB: Main (C41.2 R28.2), MCU (U3.9)
VSENSE_MC: Main (C39.2 R27.2), MCU (U3.10)